# EAGLE design e-Tapperhandpiece31 (EAGLE 8.5.1)
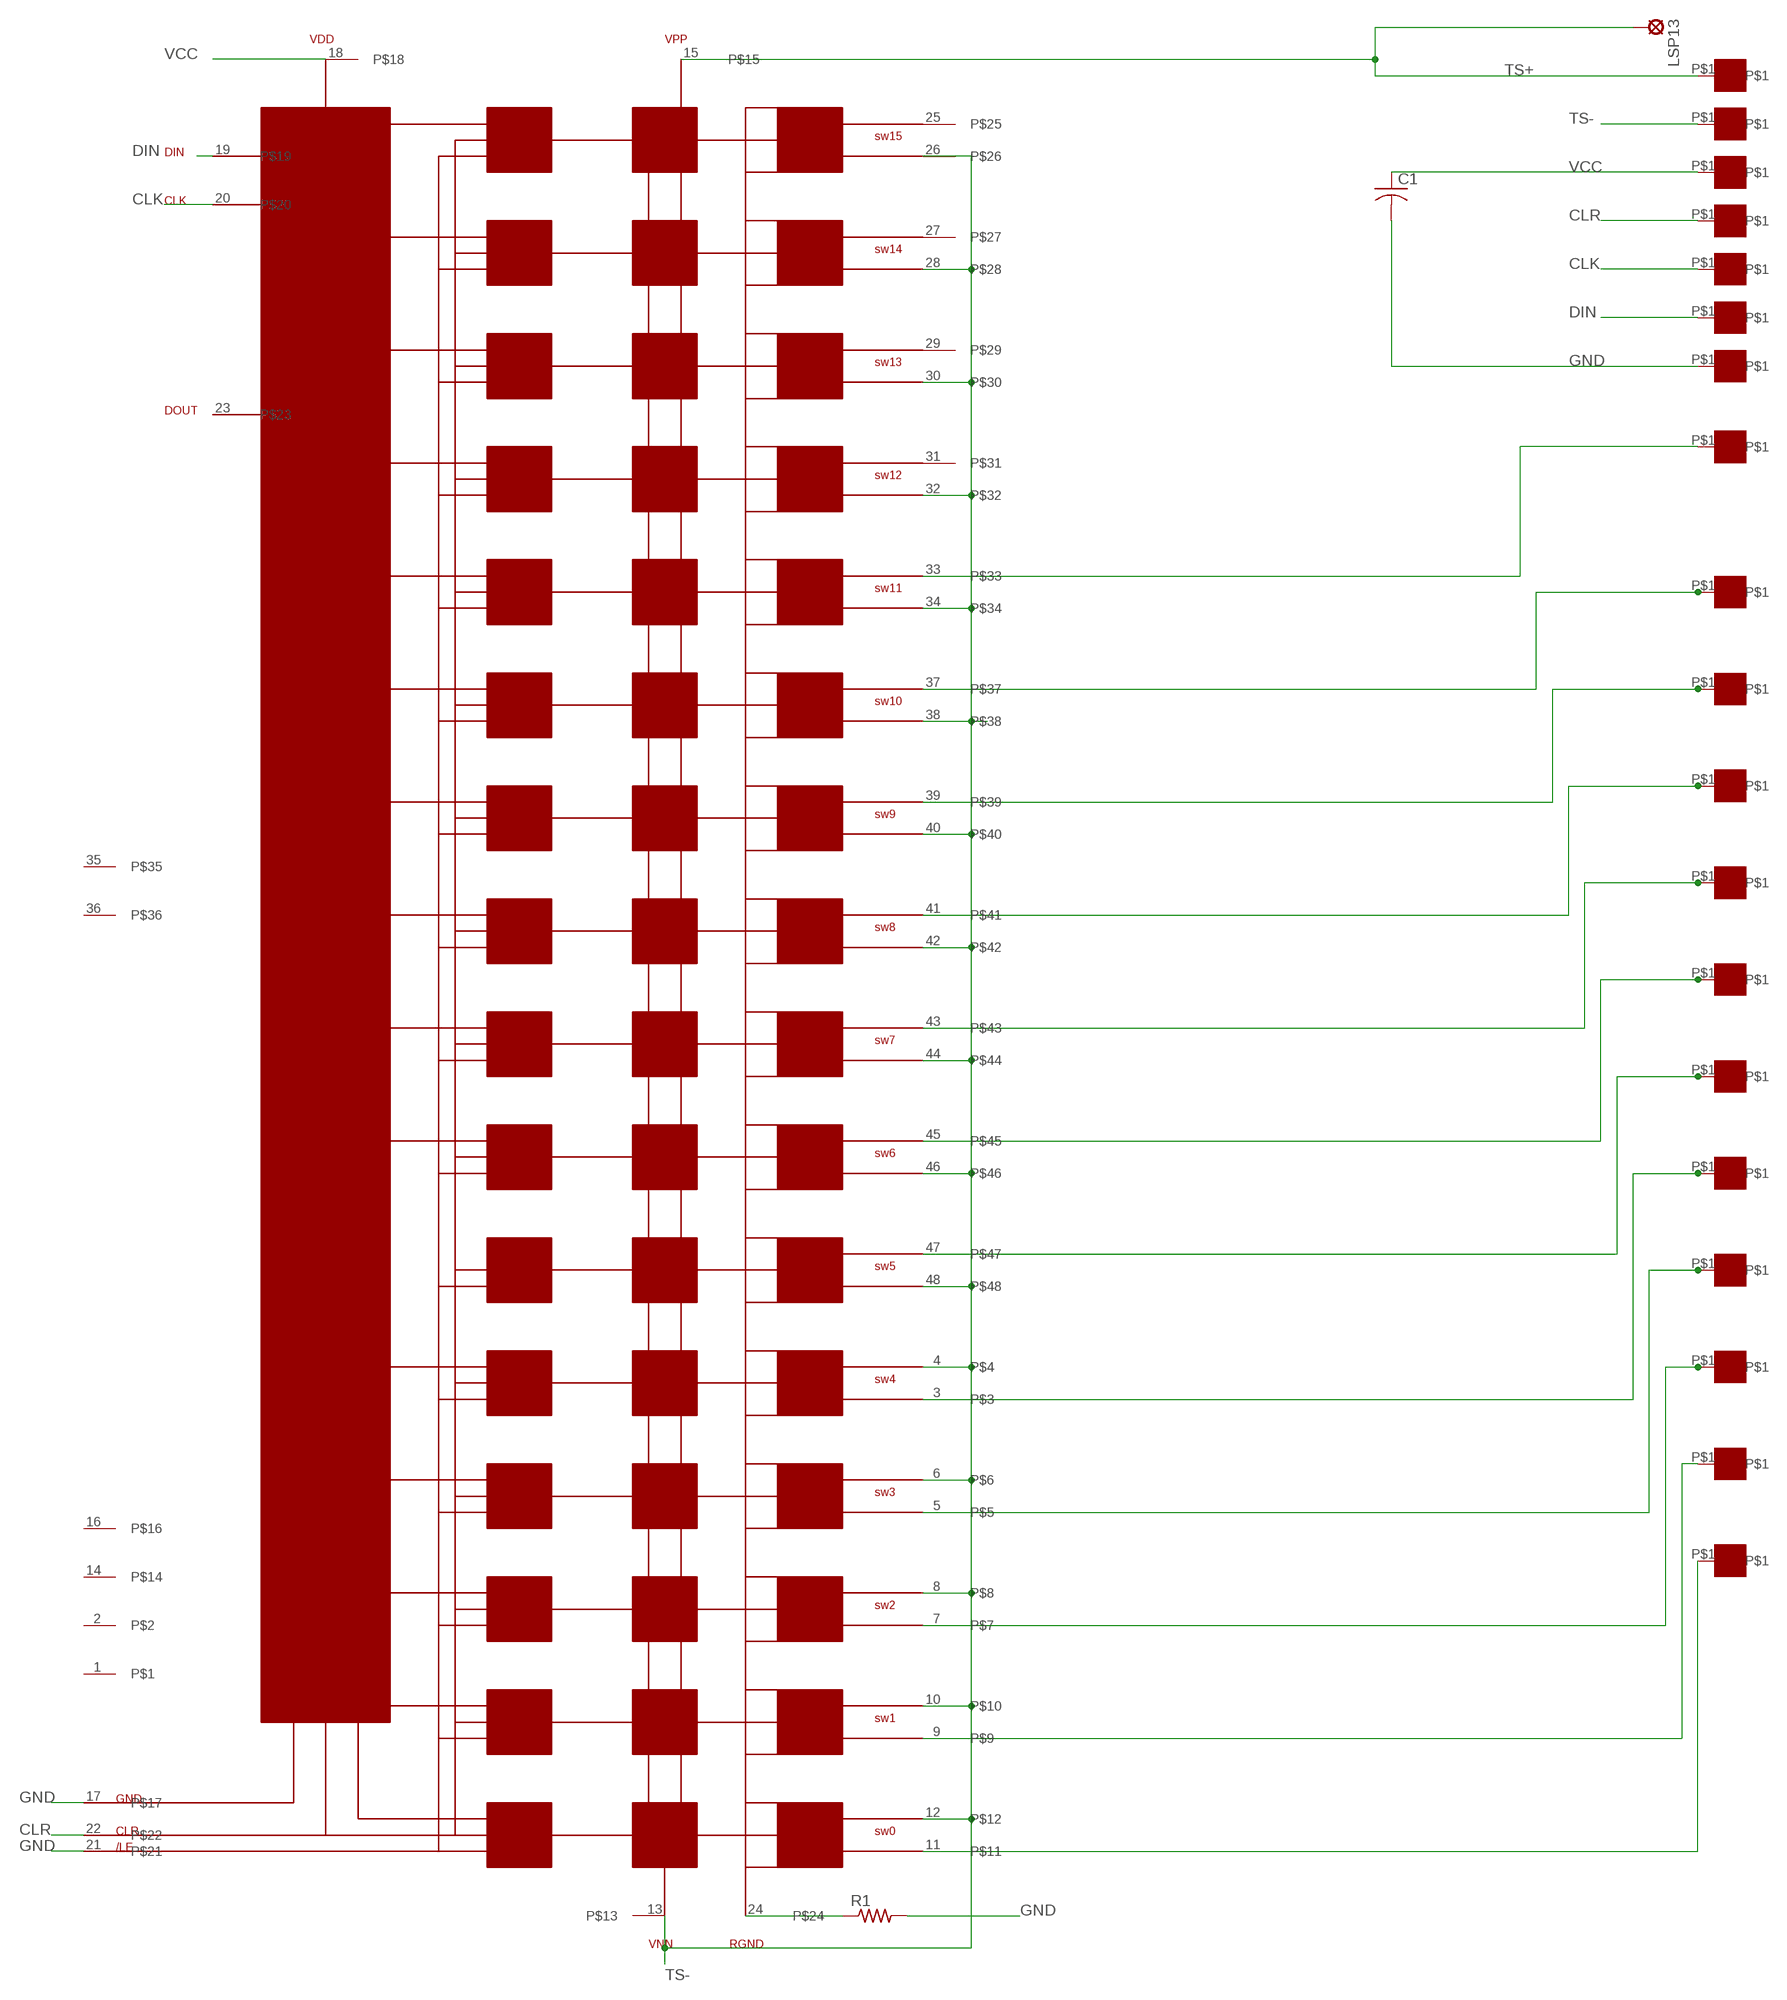
[diagram p0: schematic, sheet 1]

## Parts
C1  C-USC0805  [C0805]
LSP13  SE11  [SE11]
R1  R-US_R0805  [R0805]
TSP1  ET1  [ET1]
TSP2  ET1  [ET1]
TSP3  ET1  [ET1]
TSP4  ET1  [ET1]
TSP5  ET1  [ET1]
TSP6  ET1  [ET1]
TSP7  ET1  [ET1]
TSP8  ET1  [ET1]
TSP9  ET1  [ET1]
TSP10  ET1  [ET1]
TSP11  ET1  [ET1]
TSP12  ET1  [ET1]
TSP13  ET1  [ET1]
TSP14  ET1  [ET1]
TSP16  ET1  [ET1]
TSP17  ET1  [ET1]
TSP18  ET1  [ET1]
TSP19  ET1  [ET1]
U1  CPC7701  [LQFP48]
VCC  ET1  [ET1]

## Nets
CLK: TSP17.P$1 U1.20
CLR: TSP18.P$1 U1.22
DIN: TSP16.P$1 U1.19
GND: C1.2 R1.2 TSP19.P$1 U1.17 U1.21
N$1: R1.1 U1.24
N$4: TSP1.P$1 U1.33
N$6: TSP2.P$1 U1.37
N$10: TSP3.P$1 U1.39
N$11: TSP4.P$1 U1.41
N$12: TSP5.P$1 U1.43
N$13: TSP6.P$1 U1.45
N$14: TSP7.P$1 U1.47
N$15: TSP8.P$1 U1.3
N$16: TSP9.P$1 U1.5
N$17: TSP10.P$1 U1.7
N$21: TSP11.P$1 U1.9
N$26: TSP12.P$1 U1.11
TS+: LSP13.MP TSP13.P$1 U1.15
TS-: TSP14.P$1 U1.4 U1.6 U1.8 U1.10 U1.12 U1.13 U1.26 U1.28 U1.30 U1.32 U1.34 U1.38 U1.40 U1.42 U1.44 U1.46 U1.48
VCC: C1.1 U1.18 VCC.P$1
Unconnected: U1.1 U1.2 U1.14 U1.16 U1.23 U1.25 U1.27 U1.29 U1.31 U1.35 U1.36

## Library data of the parts
C1 = resistor:C-US: CAPACITOR, American symbol
LSP13 = solpad:SE11: SOLDER PAD RTM, drill 1,1mm, distributor Buerklin, 07F810
R1 = rcl:R-US_: RESISTOR, American symbol; SPICEPREFIX: R
TSP1-TSP14 TSP16-TSP19 VCC = ET1:ET1: Through Hold Pads 35 mil drill hole
U1 = CPC7701:CPC7701: High Voltage cmos 16 channel analog switch in 48 plcc package 3.3V logic level 200V switch

## Net classes
0 default: clearance 0.205 mm

## Board
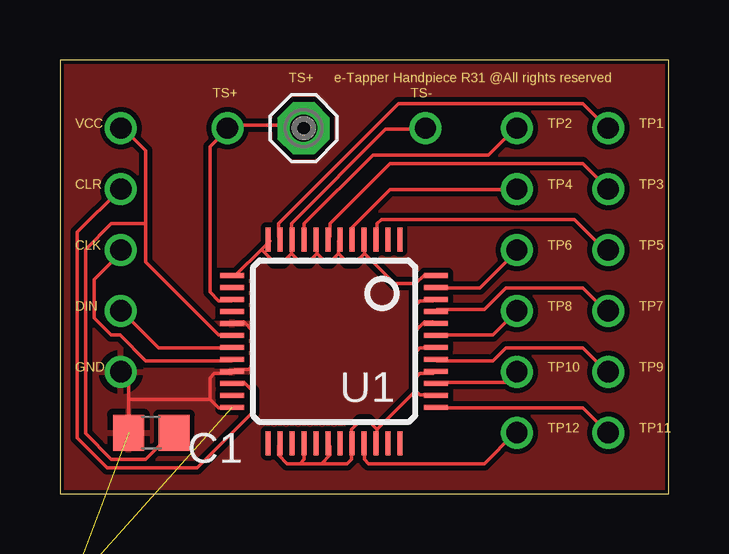
[diagram p1: board, top side]
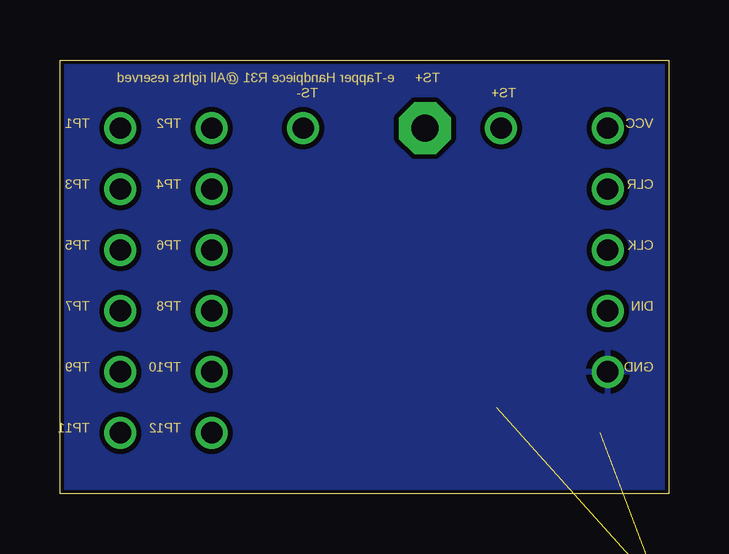
[diagram p2: board, bottom side, seen from below]

Size 25.38 x 18.09 mm. Coordinates in mm from the lower left corner, seen from the top.
Outline: 0,0 25.38,0 25.38,18.09 0,18.09 0,0
Copper layers (1*16): Top 0.035mm / dielectric 1.5mm / Bottom 0.035mm
Design rules "e-tapperhandpiece14 *": minimum track width 6mil, minimum drill 15mil, track to track 6mil, track to pad 6mil, pad to pad 6mil, via to via 6mil, smd to smd 6mil, copper to edge 6mil, drill to drill 6mil, minimum pad ring 6mil, minimum via ring 6mil, stop-mask expansion 4mil, vias tented up to drill 0mil, thermal gap 10mil

### Footprints (pad centres in the part's own frame; a part is rotated, then mirrored left to right if it is on the bottom)
C0805 = smd 1.3 x 1.5: 1 -0.95,0; 2 0.95,0
SE11 = drill 1.118 pad 2.159 octagon: MP 0,0
R0805 = smd 1.3 x 1.5: 1 -0.95,0; 2 0.95,0
ET1 = drill 0.889: P$1 0,0
LQFP48 = smd 0.2 x 1: 1 -2.75,-4.25; 2 -2.25,-4.25; 3 -1.75,-4.25; 4 -1.25,-4.25; 5 -0.75,-4.25; 6 -0.25,-4.25; 7 0.25,-4.25; 8 0.75,-4.25; 9 1.25,-4.25; 10 1.75,-4.25; 11 2.25,-4.25; 12 2.75,-4.25; 25 2.75,4.25; 26 2.25,4.25; 27 1.75,4.25; 28 1.25,4.25; 29 0.75,4.25; 30 0.25,4.25; 31 -0.25,4.25; 32 -0.75,4.25; 33 -1.25,4.25; 34 -1.75,4.25; 35 -2.25,4.25; 36 -2.75,4.25 | smd 1 x 0.2: 13 4.25,-2.75; 14 4.25,-2.25; 15 4.25,-1.75; 16 4.25,-1.25; 17 4.25,-0.75; 18 4.25,-0.25; 19 4.25,0.25; 20 4.25,0.75; 21 4.25,1.25; 22 4.25,1.75; 23 4.25,2.25; 24 4.25,2.75; 37 -4.25,2.75; 38 -4.25,2.25; 39 -4.25,1.75; 40 -4.25,1.25; 41 -4.25,0.75; 42 -4.25,0.25; 43 -4.25,-0.25; 44 -4.25,-0.75; 45 -4.25,-1.25; 46 -4.25,-1.75; 47 -4.25,-2.25; 48 -4.25,-2.75

### Placement (x,y rotation side)
C1  3.81,2.54 180 top
LSP13  10.16,15.24 0 top
R1  -1.91,-7.62 0 top  (outside the outline)
TSP1  19.05,2.54 0 top
TSP2  22.86,2.54 0 top
TSP3  19.05,5.08 0 top
TSP4  22.86,5.08 0 top
TSP5  19.05,7.62 0 top
TSP6  22.86,7.62 0 top
TSP7  19.05,10.16 0 top
TSP8  22.86,10.16 0 top
TSP9  19.05,12.7 0 top
TSP10  22.86,12.7 0 top
TSP11  19.05,15.24 0 top
TSP12  22.86,15.24 0 top
TSP13  6.99,15.24 0 top
TSP14  15.24,15.24 0 top
TSP16  2.54,7.62 180 top
TSP17  2.54,10.16 180 top
TSP18  2.54,12.7 270 top
TSP19  2.54,5.08 270 top
U1  11.43,6.35 180 top
VCC  2.54,15.24 180 top

### Tracks (layer width: path | path; a pad name or v marks a point on that pad's centre or on a via)
CLK
  Top 0.152: U1.20 7.15,5.54 3.57,5.54 2.5,6.61 2.14,6.61 1.43,7.33 1.43,8.94 2.5,10.01 TSP17.P$1
CLR
  Top 0.152: U1.22 7.33,4.65 7.68,4.65 8.04,4.29 8.04,3.4 5.72,1.07 1.97,1.07 0.71,2.32 0.71,10.9 2.5,12.69 TSP18.P$1
DIN
  Top 0.152: U1.19 7.15,6.08 4.11,6.08 2.68,7.5 TSP16.P$1
GND  (1 unrouted)
  Top 0.152: 7.15,3.57 6.61,3.57 6.25,3.93 | 6.25,3.93 6.25,4.83 6.43,5 7.15,5 U1.21 7.33,5.18 7.86,5.18 8.04,5.36 8.04,6.79 7.68,7.15 7.33,7.15 U1.17 | 2.86,3.93 2.86,4.83 2.68,5 TSP19.P$1 | 2.86,3.93 2.86,2.68 C1.2 | 2.86,3.93 6.25,3.93
  pour Top: 0,18.41 25.4,18.41 25.4,0 0,0
  pour Bottom: 0,18.41 25.4,18.41 25.4,0 0,0
N$1  (1 unrouted)
N$4
  Top 0.152: U1.33 12.69,1.97 12.69,1.43 12.87,1.25 17.69,1.25 18.94,2.5 TSP1.P$1
N$6
  Top 0.152: U1.37 15.73,3.57 21.8,3.57 22.7,2.68 TSP2.P$1
N$10
  Top 0.152: U1.39 15.73,4.65 18.59,4.65 18.94,5 TSP3.P$1
N$11
  Top 0.152: U1.41 15.73,5.54 18.05,5.54 18.59,6.08 21.8,6.08 22.7,5.18 TSP4.P$1
N$12
  Top 0.152: U1.43 15.73,6.61 18.05,6.61 18.94,7.5 TSP5.P$1
N$13
  Top 0.152: U1.45 15.73,7.68 17.69,7.68 18.59,8.58 21.8,8.58 22.7,7.68 TSP6.P$1
N$14
  Top 0.152: U1.47 15.73,8.58 17.51,8.58 18.94,10.01 TSP7.P$1
N$15
  Top 0.152: U1.3 13.22,10.72 13.22,11.26 13.4,11.44 21.44,11.44 22.7,10.19 TSP8.P$1
N$16
  Top 0.152: U1.5 12.15,10.72 12.15,11.08 13.76,12.69 18.94,12.69 TSP9.P$1
N$17
  Top 0.152: U1.7 11.26,10.72 11.26,11.26 13.76,13.76 21.8,13.76 22.7,12.87 TSP10.P$1
N$21
  Top 0.152: U1.9 10.19,10.72 10.19,11.26 13.04,14.12 17.87,14.12 18.94,15.19 TSP11.P$1
N$26
  Top 0.152: U1.11 9.11,10.72 9.11,11.26 14.12,16.26 21.8,16.26 22.7,15.37 TSP12.P$1
TS+
  Top 0.152: U1.15 7.15,8.04 6.61,8.04 6.25,8.4 6.25,14.47 6.97,15.19 TSP13.P$1 7.15,15.37 10.01,15.37 LSP13.MP
TS-
  Top 0.152: 10.01,1.25 9.47,1.25 9.11,1.61 9.11,1.97 U1.26 | 10.01,1.25 10.19,1.43 10.19,1.97 U1.28 | 10.9,1.25 11.26,1.61 11.26,1.97 U1.30 | 10.01,1.25 10.9,1.25 | 10.9,1.25 11.97,1.25 12.15,1.43 12.15,1.97 U1.32 12.15,2.14 12.15,2.68 12.51,3.04 12.87,3.04 13.22,2.68 | 13.22,2.68 13.22,2.14 U1.34 | 14.83,4.29 15.01,4.11 15.55,4.11 U1.38 | 14.83,4.83 14.83,4.29 | 14.83,4.83 15.01,5 15.55,5 U1.40 | 14.83,5.9 15.01,6.08 15.55,6.08 U1.42 | 14.83,4.83 14.83,5.9 | 14.83,6.79 15.19,7.15 15.55,7.15 U1.44 | 14.83,5.9 14.83,6.79 | 14.83,7.86 15.01,8.04 15.55,8.04 U1.46 | 14.83,6.79 14.83,7.86 | 14.83,8.76 15.19,9.11 15.55,9.11 U1.48 | 14.83,7.86 14.83,8.76 | 14.83,4.29 13.22,2.68 | 8.4,10.19 8.76,10.54 U1.12 | 8.4,10.19 7.33,9.11 U1.13 | 9.65,10.01 9.65,10.54 U1.10 9.65,10.72 9.65,11.26 13.58,15.19 15.19,15.19 TSP14.P$1 | 9.65,10.01 9.29,9.65 8.94,9.65 8.4,10.19 | 10.72,10.01 10.72,10.54 U1.8 | 10.72,10.01 10.37,9.65 10.01,9.65 9.65,10.01 | 11.62,10.01 11.62,10.54 U1.6 | 11.62,10.01 11.26,9.65 11.08,9.65 10.72,10.01 | 12.69,10.01 12.69,10.54 U1.4 | 12.69,10.01 12.33,9.65 11.97,9.65 11.62,10.01 | 14.83,8.76 13.94,8.76 12.69,10.01
VCC
  Top 0.152: 3.57,11.26 3.57,14.3 2.68,15.19 VCC.P$1 | 3.57,11.26 3.57,9.65 6.61,6.61 7.15,6.61 U1.18 | 3.57,11.26 2.14,11.26 1.07,10.19 1.07,2.5 2.14,1.43 3.57,1.43 4.65,2.5 C1.1

### Text on the board
Dimension: TS+ | TS+ | e-Tapper Handpiece R31 @All rights reserved | TS- | VCC | TP2 | TP1 | CLR | TP4 | TP3 | CLK | TP6 | TP5 | DIN | TP8 | TP7 | GND | TP10 | TP9 | TP12 | TP11